# Altium project MAGI'sBoostPower.PrjPcb
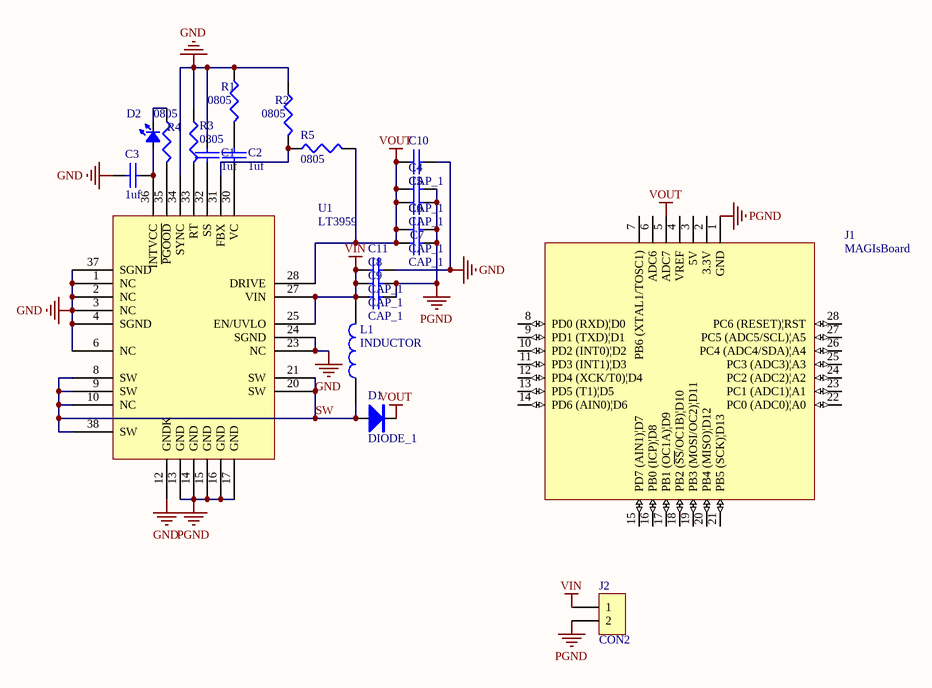
[diagram p0: MAGI'sBoostPower.SchDoc]
1 sheet, 22 parts. Net scope: global (net labels, ports and power ports of the same name join across sheets).
Board file: MAGI'sBoostPower.PcbDoc

## Sheet MAGI'sBoostPower.SchDoc
size A4

### Parts
C1  1uf  [6-0805_N]
C2  1uf  [6-0805_N]
C3  1uf  [6-0805_N]
C4  CAP_1  [C1206]
C5  CAP_1  [C1206]
C6  CAP_1  [C1206]
C7  CAP_1  [C1206]
C8  CAP_1  [C1206]
C9  CAP_1  [C1206]
C10  CAP_1  [6-0805_n]
C11  CAP_1  [6-0805_n]
D1  DIODE_1  [SMC]
D2  LED_0805  [6-0805_n]  (value not drawn)
J1  MAGIsBoard  [MAGIsBoard]
J2  CON2  [T-Mini]
L1  INDUCTOR  [10*10]
R1  0805  [6-0805_N]
R2  0805  [6-0805_N]
R3  0805  [6-0805_N]
R4  0805  [6-0805_N]
R5  0805  [6-0805_N]
U1  LT3959  [LT3959]

### Nets
GND: C1.2 C3.2 C10.2 C11.2 R1.1 R2.1 R3.1 U1.1(NC) U1.2(NC) U1.3(NC) U1.4(SGND) U1.6(NC) U1.12(GNDK) U1.23(NC) U1.24(SGND) U1.34(SYNC) U1.37(SGND)
PGND: C4.2 C5.2 C6.2 C7.2 C8.2 C9.2 J1.1(GND) J2.2 U1.13(GND) U1.14(GND) U1.15(GND) U1.16(GND) U1.17(GND)
VIN: C8.1 C9.1 C11.1 J2.1 L1.2 U1.25(EN/UVLO) U1.27(VIN)
VOUT: C4.1 C5.1 C6.1 C7.1 C10.1 D1.2(K) J1.5(ADC7) R5.2 U1.28(DRIVE)
SW: D1.1(A) L1.1 U1.8(SW) U1.9(SW) U1.10(NC) U1.20(SW) U1.21(SW) U1.38(SW)
NetC1_1: C1.1 U1.32(SS)
NetC2_1: C2.1 U1.30(VC)
NetC2_2: C2.2 R1.2
NetC3_1: C3.1 D2.1(A) U1.36(INTVCC)
NetD2_2: D2.2(K) R4.1
NetR2_2: R2.2 R5.1 U1.31(FBX)
NetR3_2: R3.2 U1.33(RT)
NetR4_2: R4.2 U1.35(~{PGOOD})

Not connected (* = marked no-connect by the designer): J1 2(3.3V) 3(5V) 4(VREF) 6(ADC6) 7(PB6_(XTAL1/TOSC1)) 8(PD0_(RXD)|D0) 9(PD1_(TXD)|D1) 10(PD2_(INT0)|D2) 11(PD3_(INT1)|D3) 12(PD4_(XCK/T0)|D4) 13(PD5_(T1)|D5) 14(PD6_(AIN0)|D6) 15(PD7_(AIN1)|D7) 16(PB0_(ICP)|D8) 17(PB1_(OC1A)|D9) 18(PB2_(~{SS}/OC1B)|D10) 19(PB3_(MOSI/OC2)|D11) 20(PB4_(MISO)|D12) 21(PB5_(SCK)|D13) 22(PC0_(ADC0)|A0) 23(PC1_(ADC1)|A1) 24(PC2_(ADC2)|A2) 25(PC3_(ADC3)|A3) 26(PC4_(ADC4/SDA)|A4) 27(PC5_(ADC5/SCL)|A5) 28(PC6_(RESET)|RST)

### Library data of the parts
C1-C11 = CAP_1: Capacitor
D1 = DIODE_1: Diode
D2 = LED_0805: LED
J2 = CON2: Connector
R1-R5 = RES1_1